# Altium project OpenSwitch.PrjPCB
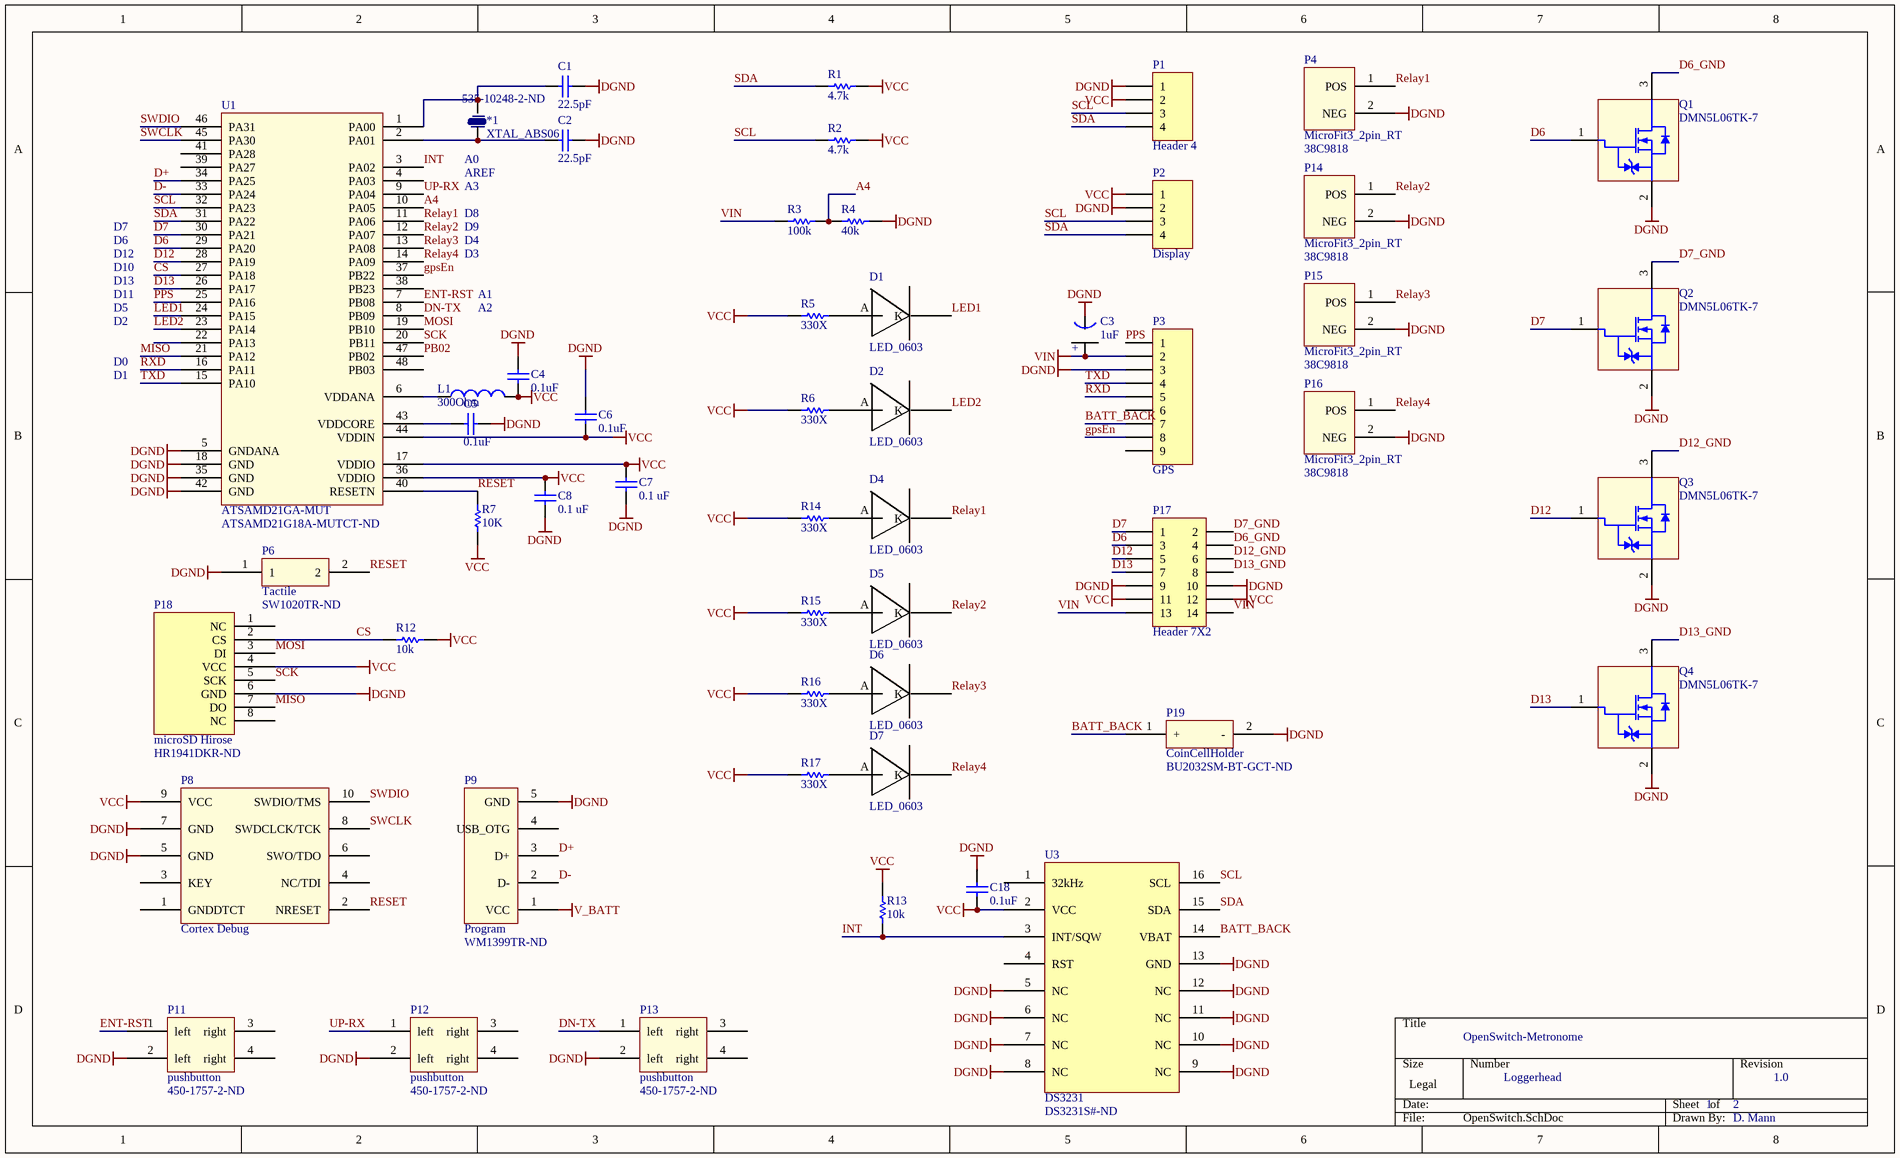
[diagram p0: OpenSwitch.SchDoc]
2 sheets, 73 parts. Net scope: global (net labels, ports and power ports of the same name join across sheets).
Board file: OpenSwitch.PcbDoc
Sheets:
  OpenSwitch.SchDoc
  OpenSwitch_Power.SchDoc

## Sheet OpenSwitch.SchDoc
size Legal

### Parts
*1  XTAL_ABS06  Supplier Part Number 1: 535-10248-2-ND  [XTAL-ABS06]
C1  22.5pF  [0402]
C2  22.5pF  [0402]
C3  1uF  [Tant0805]
C4  0.1uF  [0402]
C5  0.1uF  [0402]
C6  0.1uF  [0402]
C7  0.1 uF  [0402]
C8  0.1 uF  [0402]
C18  0.1uF  [0402]
D1  LED_0603  [Diode0603]
D2  LED_0603  [Diode0603]
D4  LED_0603  [Diode0603]
D5  LED_0603  [Diode0603]
D6  LED_0603  [Diode0603]
D7  LED_0603  [Diode0603]
L1  300Ohm  [0805 (M2125) Ferrite]
P1  Header 4  [HDR1X4]
P2  Display  [HDR1X4]
P3  GPS  [HDR1X9]
P4  MicroFit3_2pin_RT  Supplier Part Number 1: 38C9818  [Microfit 3 - 2 pin RT]
P6  Tactile  Supplier Part Number 1: SW1020TR-ND  [Tactile-B3U-1000]
P8  Cortex Debug  [Header_2x5_50mil]
P9  Program  Supplier Part Number 1: WM1399TR-ND  [microUSB-B]
P11  pushbutton  Supplier Part Number 1: 450-1757-2-ND  [SOP4]
P12  pushbutton  Supplier Part Number 1: 450-1757-2-ND  [SOP4]
P13  pushbutton  Supplier Part Number 1: 450-1757-2-ND  [SOP4]
P14  MicroFit3_2pin_RT  Supplier Part Number 1: 38C9818  [Microfit 3 - 2 pin RT]
P15  MicroFit3_2pin_RT  Supplier Part Number 1: 38C9818  [Microfit 3 - 2 pin RT]
P16  MicroFit3_2pin_RT  Supplier Part Number 1: 38C9818  [Microfit 3 - 2 pin RT]
P17  Header 7X2  [HDR2X7]
P18  microSD Hirose  Supplier Part Number 1: HR1941DKR-ND  [DM3D microSD]
P19  CoinCellHolder  Supplier Part Number 1: BU2032SM-BT-GCT-ND  [CoinCellHolder]
Q1  DMN5L06TK-7  [SOT-523]
Q2  DMN5L06TK-7  [SOT-523]
Q3  DMN5L06TK-7  [SOT-523]
Q4  DMN5L06TK-7  [SOT-523]
R1  4.7k  [3-0603]
R2  4.7k  [3-0603]
R3  100k  [3-0603]
R4  40k  [3-0603]
R5  330X  [3-0603]
R6  330X  [3-0603]
R7  10K  [3-0603]
R12  10k  [3-0603]
R13  10k  [3-0603]
R14  330X  [3-0603]
R15  330X  [3-0603]
R16  330X  [3-0603]
R17  330X  [3-0603]
U1  ATSAMD21GA-MUT  Supplier Part Number 1: ATSAMD21G18A-MUTCT-ND  [QFN127P600-8N]
U3  DS3231  Supplier Part Number 1: DS3231S#-ND  [DS3231]

### Nets
DGND: C1.1 C2.1 C3.1(GND) C4.2 C5.2 C6.2 C7.2 C8.2 C18.2 P1.1 P2.2 P3.3 P4.2(NEG) P6.1 P8.5(GND) P8.7(GND) P9.5(GND) P11.2(left) P12.2(left) P13.2(left) P14.2(NEG) P15.2(NEG) P16.2(NEG) P17.9 P17.10 P18.6(GND) P19.2(-) Q1.2(S) Q2.2(S) Q3.2(S) Q4.2(S) R4.1 U1.5(GNDANA) U1.18(GND) U1.35(GND) U1.42(GND) U3.5(NC) U3.6(NC) U3.7(NC) U3.8(NC) U3.9(NC) U3.10(NC) U3.11(NC) U3.12(NC) U3.13(GND)
V_BATT: P9.1(VCC)
VCC: C4.1 C6.1 C7.1 C8.1 C18.1 L1.2 P1.2 P2.1 P8.9(VCC) P17.11 P17.12 P18.4(VCC) R1.2 R2.2 R5.1 R6.1 R7.1 R12.1 R13.1 R14.1 R15.1 R16.1 R17.1 U1.17(VDDIO) U1.36(VDDIO) U1.44(VDDIN) U3.2(VCC)
VIN: C3.2(+) P3.2 P17.13 P17.14 R3.2
A4: R3.1 R4.2 U1.10(PA05)
BATT_BACK: P3.7 P19.1(+) U3.14(VBAT)
CS: P18.2(CS) R12.2 U1.27(PA18)
D6: P17.3 Q1.1(G) U1.29(PA20)
D6_GND: P17.4 Q1.3(D)
D7: P17.1 Q2.1(G) U1.30(PA21)
D7_GND: P17.2 Q2.3(D)
D12: P17.5 Q3.1(G) U1.28(PA19)
D12_GND: P17.6 Q3.3(D)
D13: P17.7 Q4.1(G) U1.26(PA17)
D13_GND: P17.8 Q4.3(D)
D+: P9.3(D+) U1.34(PA25)
D-: P9.2(D-) U1.33(PA24)
DN-TX: P13.1(left) U1.8(PB09)
ENT-RST: P11.1(left) U1.7(PB08)
gpsEn: P3.8 U1.37(PB22)
INT: R13.2 U1.3(PA02) U3.3(INT/SQW)
LED1: D1.K U1.24(PA15)
LED2: D2.K U1.23(PA14)
MISO: P18.7(DO) U1.21(PA12)
MOSI: P18.3(DI) U1.19(PB10)
PB02: U1.47(PB02)
PPS: P3.1 U1.25(PA16)
Relay1: D4.K P4.1(POS) U1.11(PA06)
Relay2: D5.K P14.1(POS) U1.12(PA07)
Relay3: D6.K P15.1(POS) U1.13(PA08)
Relay4: D7.K P16.1(POS) U1.14(PA09)
RESET: P6.2 P8.2(NRESET) R7.2 U1.40(RESETN)
RXD: P3.5 U1.16(PA11)
SCK: P18.5(SCK) U1.20(PB11)
SCL: P1.3 P2.3 R2.1 U1.32(PA23) U3.16(SCL)
SDA: P1.4 P2.4 R1.1 U1.31(PA22) U3.15(SDA)
SWCLK: P8.8(SWDCLCK/TCK) U1.45(PA30)
SWDIO: P8.10(SWDIO/TMS) U1.46(PA31)
TXD: P3.4 U1.15(PA10)
UP-RX: P12.1(left) U1.9(PA04)
Net*1_1: *1.1 C2.2 U1.2(PA01)
Net*1_2: *1.2 C1.2 U1.1(PA00)
NetC5_1: C5.1 U1.43(VDDCORE)
NetD1_A: D1.A R5.2
NetD2_A: D2.A R6.2
NetD4_A: D4.A R14.2
NetD5_A: D5.A R15.2
NetD6_A: D6.A R16.2
NetD7_A: D7.A R17.2
NetL1_1: L1.1 U1.6(VDDANA)

Not connected (* = marked no-connect by the designer): P3 6 9; P8 1(GNDDTCT) 3(KEY) 4(NC/TDI) 6(SWO/TDO); P9 4(USB_OTG); P11 3(right) 4(right); P12 3(right) 4(right); P13 3(right) 4(right); P18 1(NC) 8(NC); U1 4(PA03) 22(PA13) 38(PB23) 39(PA27) 41(PA28) 48(PB03); U3 1(32kHz) 4(RST)

### Notes on the sheet
- (near *1) A0
- D7
- D8
- D9
- A3
- (near *1) AREF
- D10
- D13
- D11
- D12
- D6
- D4
- D3
- A1
- D0
- D5
- D2
- A2
- D1
- OpenSwitch-Metronome
- Loggerhead
- 1
- 2
- 1.0
- D. Mann

### Library data of the parts
C1 C2 = C0402: Ceramic Chip Capacitor - Standard; Note: Footprint corresponds to dimensions for bulk cassette packaging. This case size has tightened tolerances.; Value: 12.5; Published: 17-Jul-2002; LatestRevisionDate: 19-Mar-2004; LatestRevisionNote: Silkscreen size reduced.; DatasheetDocument: Mar-2001; PackageDocument: Mar-2001; PackageReference: 0402; Publisher: Altium Limited; Code_JEITA: 0402; Code_IPC: 1005 [0402]; ComponentLink1Description: Manufacturer Link; ComponentLink1URL: http://www.kemet.com/; ComponentLink2Description: Datasheet; ComponentLink2URL: http://www.kemet.com/kemet/web/homepage/kechome.nsf/vapubfilesname/F3102TA.pdf/$file/F3102TA.pdf
C3 = Tant0805: Value: 1uF
C4-C6 C18 = C0402: Ceramic Chip Capacitor - Standard; Note: Footprint corresponds to dimensions for bulk cassette packaging. This case size has tightened tolerances.; Published: 17-Jul-2002; LatestRevisionDate: 19-Mar-2004; LatestRevisionNote: Silkscreen size reduced.; DatasheetDocument: Mar-2001; PackageDocument: Mar-2001; PackageReference: 0402; Publisher: Altium Limited; Code_JEITA: 0402; Code_IPC: 1005 [0402]; ComponentLink1Description: Manufacturer Link; ComponentLink1URL: http://www.kemet.com/; ComponentLink2Description: Datasheet; ComponentLink2URL: http://www.kemet.com/kemet/web/homepage/kechome.nsf/vapubfilesname/F3102TA.pdf/$file/F3102TA.pdf; Value: 0.1uF
C7 C8 = C0402: Ceramic Chip Capacitor - Standard; Note: Footprint corresponds to dimensions for bulk cassette packaging. This case size has tightened tolerances.; Value: 0.1uF; Published: 17-Jul-2002; LatestRevisionDate: 19-Mar-2004; LatestRevisionNote: Silkscreen size reduced.; DatasheetDocument: Mar-2001; PackageDocument: Mar-2001; PackageReference: 0402; Publisher: Altium Limited; Code_JEITA: 0402; Code_IPC: 1005 [0402]; ComponentLink1Description: Manufacturer Link; ComponentLink1URL: http://www.kemet.com/; ComponentLink2Description: Datasheet; ComponentLink2URL: http://www.kemet.com/kemet/web/homepage/kechome.nsf/vapubfilesname/F3102TA.pdf/$file/F3102TA.pdf
L1 = Ferrite 0805(M2125) 3A: Ferrite 25mOhm@DC,  60 Ohm@100MHz; Fabrication Tested: NO; Creator and Date: Design Engineer's Name; Footprint Verified By: *; Schematic Verified By: *; Vendor Info Verified By: *; Value: 300Ohm; HelpURL: http://www.yuden.co.jp/ut/product/pdf/mlci08_e.pdf; Mass (place origin at center): *; Supplier 1: Digi-Key; Supplier Part Number 1: 587-1932-1-ND; Supplier 2: Newark; Supplier Part Number 2: 73M9170
P1 P2 = Header 4: Header, 4-Pin; LatestRevisionDate: 17-Jul-2002; LatestRevisionNote: Re-released for DXP Platform.; Publisher: Altium Limited
P3 = Header 9: Header, 9-Pin; LatestRevisionDate: 17-Jul-2002; LatestRevisionNote: Re-released for DXP Platform.; Publisher: Altium Limited
P6 = Tactile_B3U-1000: Supplier 1: Digi-Key
P8 = CortexDebug
P9 = microUSB-B: Supplier 1: Digi-Key
P17 = Header 7X2: Header, 7-Pin, Dual row; LatestRevisionDate: 17-Jul-2002; LatestRevisionNote: Re-released for DXP Platform.; Publisher: Altium Limited
Q1-Q4 = FET DMN5L06TK-7: Ultra-low leakage Enhanced MOSFET; Fabrication Tested: NO; Creator and Date: Will Flanery 2010-09-02; Footprint Verified By: *; Schematic Verified By: *; Vendor Info Verified By: *; Supplier 1: Digi-Key; Supplier Part Number 1: DMN5L06TKDICT-ND; HelpURL: http://www.diodes.com/datasheets/ds30926.pdf
R1-R7 R12-R17 = ERJ3RK: Precision Thick Film Chip Resistor, 10 Ohm to 1M Ohm Range, 1% and 0.5% Tolerance, 0603 Size, 0.063 W; Published: 17-Dec-2003; LatestRevisionDate: 19-Mar-2004; LatestRevisionNote: Silkscreen size reduced.; PackageDocument: Mar-2003; PackageReference: 3-0603; Publisher: Altium Limited; Code_IPC: 1608 [0603]; ComponentLink1Description: Manufacturer Link; ComponentLink1URL: http://www.panasonic.com/industrial/components/resistive_products.htm; ComponentLink2Description: Datasheet; ComponentLink2URL: http://www.panasonic.com/industrial/components/pdf/AOA0000CE2.pdf
U1 = ATSAMD21G18: Supplier 1: Digi-Key
*1 = XTAL_ABS06: Supplier 1: Digi-Key
P4 P14-P16 = MicroFit3_2pin_RT: Supplier 1: Newark
P11-P13 = pushbutton: Supplier 1: Digi-Key
P18 = microSD Hirose: Supplier 1: Digi-Key
P19 = CoinCellHolder: Supplier 1: Digi-Key
U3 = DS3231: Supplier 1: Digi-Key

## Sheet OpenSwitch_Power.SchDoc
size A
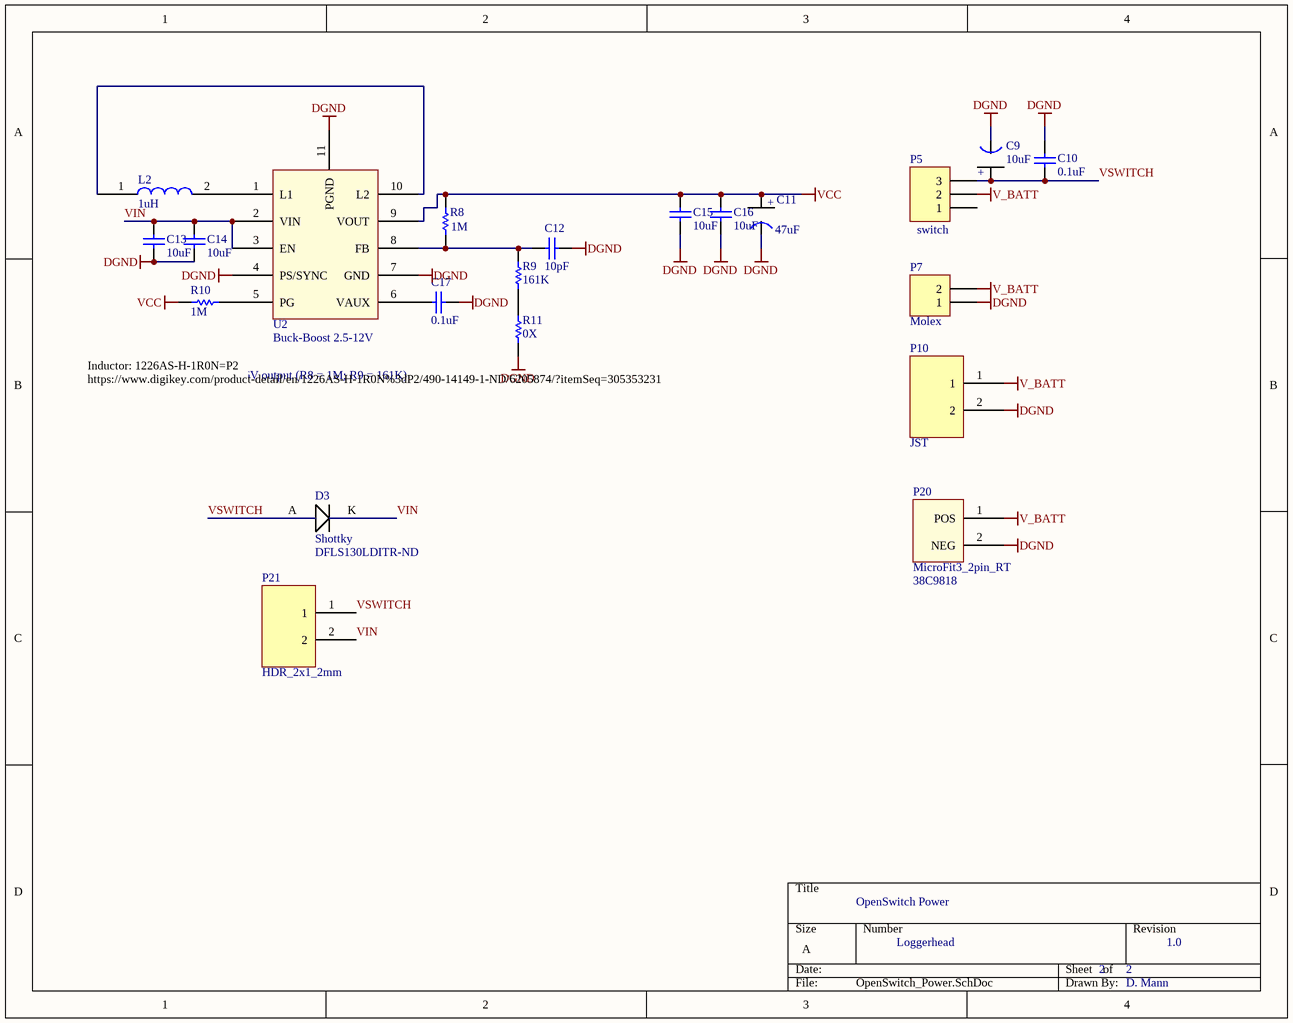
[diagram p1: OpenSwitch_Power.SchDoc]

### Parts
C9  10uF  [Tant0805]
C10  0.1uF  [0402]
C11  47uF  [Tant0805]
C12  10pF  [0402]
C13  10uF  [0603]
C14  10uF  [0603]
C15  10uF  [0603]
C16  10uF  [0603]
C17  0.1uF  [0402]
D3  Shottky  Supplier Part Number 1: DFLS130LDITR-ND  [DFLS130]
L2  1uH  [Inductor_NLV32T]
P5  switch  [HDR1X3]
P7  Molex  [HDR1X2]
P10  JST  [HDR_2x1_2mm]
P20  MicroFit3_2pin_RT  Supplier Part Number 1: 38C9818  [Microfit 3 - 2 pin RT]
P21  HDR_2x1_2mm  [HDR_2x1_2mm]
R8  1M  [3-0603]
R9  161K  [3-0603]
R10  1M  [3-0603]
R11  0X  [3-0603]
U2  Buck-Boost 2.5-12V  [TPS63060]

### Nets
DGND: C9.1(GND) C10.2 C11.1(GND) C12.2 C13.1 C14.1 C15.1 C16.1 C17.2 P7.1 P10.2 P20.2(NEG) R11.1 U2.4(PS/SYNC) U2.7(GND) U2.11(PGND)
V_BATT: P5.2 P7.2 P10.1 P20.1(POS)
VCC: C11.2(+) C15.2 C16.2 R8.2 R10.1 U2.9(VOUT)
VIN: C13.2 C14.2 D3.K P21.2 U2.2(VIN) U2.3(EN)
VSWITCH: C9.2(+) C10.1 D3.A P5.3 P21.1
NetC12_1: C12.1 R8.1 R9.2 U2.8(FB)
NetC17_1: C17.1 U2.6(VAUX)
NetL2_1: L2.1 U2.10(L2)
NetL2_2: L2.2 U2.1(L1)
NetR9_1: R9.1 R11.2
NetR10_2: R10.2 U2.5(PG)

Not connected (* = marked no-connect by the designer): P5 1

### Notes on the sheet
- 3.6V output (R8 = 1M; R9 = 161K)
- Inductor: 1226AS-H-1R0N=P2
  https://www.digikey.com/product-detail/en/1226AS-H-1R0N%3dP2/490-14149-1-ND/6205874/?itemSeq=305353231
- OpenSwitch Power
- Loggerhead
- 2
- 1.0
- D. Mann

### Library data of the parts
C9 = Tant0805: Value: 10uF
C10 C17 = C0402: as C4 on sheet OpenSwitch; Published: 17-Jul-2002; LatestRevisionDate: 19-Mar-2004; LatestRevisionNote: Silkscreen size reduced.; DatasheetDocument: Mar-2001; PackageDocument: Mar-2001; PackageReference: 0402; Publisher: Altium Limited; Code_JEITA: 0402; Code_IPC: 1005 [0402]; ComponentLink1Description: Manufacturer Link; ComponentLink1URL: http://www.kemet.com/; ComponentLink2Description: Datasheet; ComponentLink2URL: http://www.kemet.com/kemet/web/homepage/kechome.nsf/vapubfilesname/F3102TA.pdf/$file/F3102TA.pdf; Value: 0.1uF
C11 = Tant0805: Value: 10uF
C12 = C0402: as C7 on sheet OpenSwitch; Published: 17-Jul-2002; LatestRevisionDate: 19-Mar-2004; LatestRevisionNote: Silkscreen size reduced.; DatasheetDocument: Mar-2001; PackageDocument: Mar-2001; PackageReference: 0402; Publisher: Altium Limited; Code_JEITA: 0402; Code_IPC: 1005 [0402]; ComponentLink1Description: Manufacturer Link; ComponentLink1URL: http://www.kemet.com/; ComponentLink2Description: Datasheet; ComponentLink2URL: http://www.kemet.com/kemet/web/homepage/kechome.nsf/vapubfilesname/F3102TA.pdf/$file/F3102TA.pdf
C13-C16 = C0603: Ceramic Chip Capacitor - Standard; Note: Footprint corresponds to dimensions for bulk cassette packaging. This case size has tightened tolerances.; Published: 17-Jul-2002; LatestRevisionDate: 19-Mar-2004; LatestRevisionNote: Silkscreen size reduced.; DatasheetDocument: Mar-2001; PackageDocument: Mar-2001; PackageReference: 0603; Publisher: Altium Limited; Code_JEITA: 0603; Code_IPC: 1608 [0603]; ComponentLink1Description: Manufacturer Link; ComponentLink1URL: http://www.kemet.com/; ComponentLink2Description: Datasheet; ComponentLink2URL: http://www.kemet.com/kemet/web/homepage/kechome.nsf/vapubfilesname/F3102TA.pdf/$file/F3102TA.pdf
D3 = DFLS130: Supplier 1: Digi-Key
L2 = Inductor_NLV32T: Supplier 1: Mouser
P5 = Header 3: Header, 3-Pin; LatestRevisionDate: 17-Jul-2002; LatestRevisionNote: Re-released for DXP Platform.; Publisher: Altium Limited
P7 = Header 2: Header, 2-Pin; LatestRevisionDate: 17-Jul-2002; LatestRevisionNote: Re-released for DXP Platform.; Publisher: Altium Limited
P10 = HDR_2x1_2mm
R8-R11 = ERJ3RK: as R1 on sheet OpenSwitch; Published: 17-Dec-2003; LatestRevisionDate: 19-Mar-2004; LatestRevisionNote: Silkscreen size reduced.; PackageDocument: Mar-2003; PackageReference: 3-0603; Publisher: Altium Limited; Code_IPC: 1608 [0603]; ComponentLink1Description: Manufacturer Link; ComponentLink1URL: http://www.panasonic.com/industrial/components/resistive_products.htm; ComponentLink2Description: Datasheet; ComponentLink2URL: http://www.panasonic.com/industrial/components/pdf/AOA0000CE2.pdf
U2 = TPS63060: Supplier 1: Newark; Supplier Part Number 1: 82T9733
P20 = MicroFit3_2pin_RT: Supplier 1: Newark

## Nets that join several sheets
DGND: OpenSwitch (45 pins), OpenSwitch_Power (16 pins)
V_BATT: OpenSwitch (P9.1), OpenSwitch_Power (P5.2 P7.2 P10.1 P20.1)
VCC: OpenSwitch (27 pins), OpenSwitch_Power (6 pins)
VIN: OpenSwitch (5 pins), OpenSwitch_Power (6 pins)